# EAGLE schematic mainboard (EAGLE 6.3)

## Sheet 1 of 2
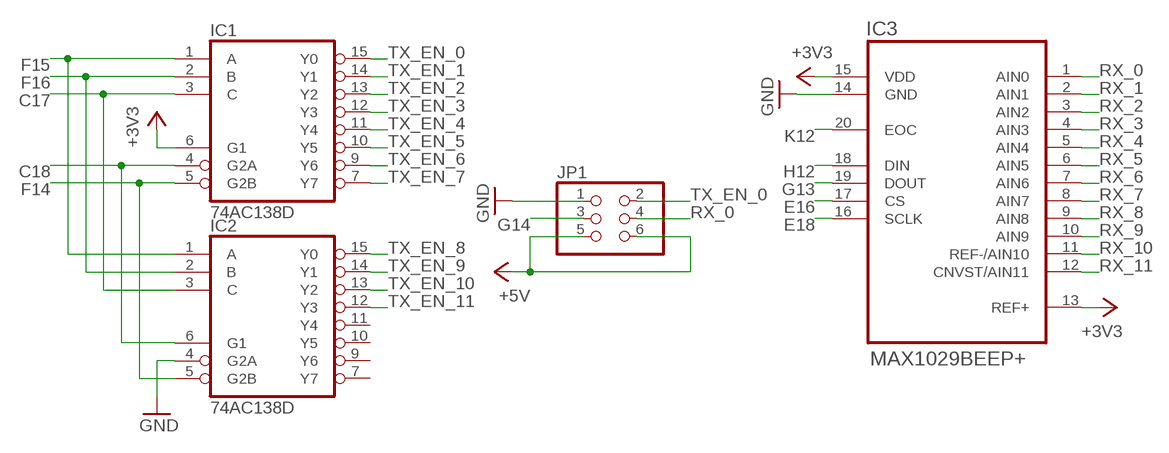
[diagram p0: schematic, sheet 1]

### Parts
IC1  74AC138D  [SO16]
IC2  74AC138D  [SO16]
IC3  MAX1029BEEP+  [SOP64P600X165-20N]
JP1  PINHD-2X3  [2X03]

### Nets
+3V3: IC1.6(G1) IC3.13(REF+) IC3.15(VDD) ; also sheet 2
+5V: JP1.5 JP1.6 ; also sheet 2
C17: IC1.3(C) IC2.3(C) ; also sheet 2
C18: IC1.4(G2A) IC2.6(G1) ; also sheet 2
E16: IC3.17(CS) ; also sheet 2
E18: IC3.16(SCLK) ; also sheet 2
F14: IC1.5(G2B) IC2.5(G2B) ; also sheet 2
F15: IC1.1(A) IC2.1(A) ; also sheet 2
F16: IC1.2(B) IC2.2(B) ; also sheet 2
G13: IC3.19(DOUT) ; also sheet 2
G14: JP1.3 ; also sheet 2
GND: IC2.4(G2A) IC3.14(GND) JP1.1 ; also sheet 2
H12: IC3.18(DIN) ; also sheet 2
K12: IC3.20(EOC) ; also sheet 2
RX_0: IC3.1(AIN0) JP1.4
RX_1: IC3.2(AIN1)
RX_2: IC3.3(AIN2)
RX_3: IC3.4(AIN3)
RX_4: IC3.5(AIN4)
RX_5: IC3.6(AIN5)
RX_6: IC3.7(AIN6)
RX_7: IC3.8(AIN7)
RX_8: IC3.9(AIN8)
RX_9: IC3.10(AIN9)
RX_10: IC3.11(REF-/AIN10)
RX_11: IC3.12(CNVST/AIN11)
TX_EN_0: IC1.15(Y0) JP1.2
TX_EN_1: IC1.14(Y1)
TX_EN_2: IC1.13(Y2)
TX_EN_3: IC1.12(Y3)
TX_EN_4: IC1.11(Y4)
TX_EN_5: IC1.10(Y5)
TX_EN_6: IC1.9(Y6)
TX_EN_7: IC1.7(Y7)
TX_EN_8: IC2.15(Y0)
TX_EN_9: IC2.14(Y1)
TX_EN_10: IC2.13(Y2)
TX_EN_11: IC2.12(Y3)
Unconnected: IC2.7(Y7) IC2.9(Y6) IC2.10(Y5) IC2.11(Y4)

## Sheet 2 of 2
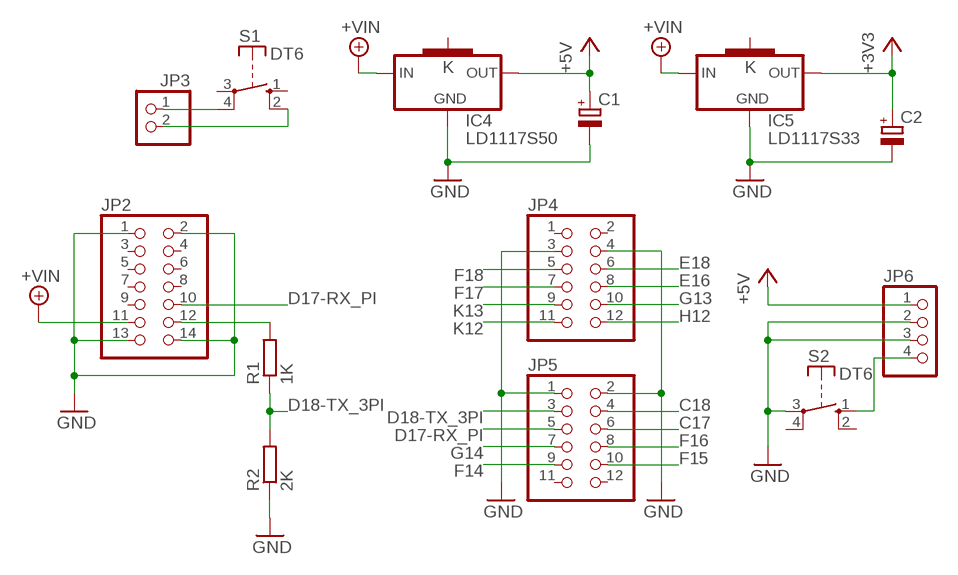
[diagram p1: schematic, sheet 2]

### Parts
C1  CPOL-EUE2.5-5  [E2,5-5]
C2  CPOL-EUE2.5-5  [E2,5-5]
IC4  LD1117S50  [SOT223]
IC5  LD1117S33  [SOT223]
JP2  PINHD-2X7  [2X07]
JP3  PINHD-1X2  [1X02]
JP4  PINHD-2X6  [2X06]
JP5  PINHD-2X6  [2X06]
JP6  PINHD-1X4  [1X04]
R1  1K  R-EU_R0805  [R0805]
R2  2K  R-EU_R0805  [R0805]
S1  DT6  [DT6]
S2  DT6  [DT6]

### Nets
+3V3: C2.+ IC5.2(OUT) ; also sheet 1
+5V: C1.+ IC4.2(OUT) JP6.1 ; also sheet 1
+VIN: IC4.3(IN) IC5.3(IN) JP2.11
C17: JP5.6 ; also sheet 1
C18: JP5.4 ; also sheet 1
D17-RX_PI: JP2.10 JP5.5
D18-TX_3PI: JP5.3 R1.1 R2.2
E16: JP4.8 ; also sheet 1
E18: JP4.6 ; also sheet 1
F14: JP5.9 ; also sheet 1
F15: JP5.10 ; also sheet 1
F16: JP5.8 ; also sheet 1
F17: JP4.7
F18: JP4.5
G13: JP4.10 ; also sheet 1
G14: JP5.7 ; also sheet 1
GND: C1.- C2.- IC4.1(GND) IC5.1(GND) JP2.1 JP2.2 JP2.13 JP2.14 JP4.3 JP4.4 JP5.1 JP5.2 JP6.2 JP6.3 R2.1 S2.3(P) ; also sheet 1
H12: JP4.12 ; also sheet 1
K12: JP4.11 ; also sheet 1
K13: JP4.9
N$1: JP6.4 S2.1(S)
N$2: JP3.1 S1.4(P)
N$3: JP3.2 S1.2(S)
TX_3PI: JP2.12 R1.2
Unconnected: IC4.4(K) IC5.4(K) JP2.3 JP2.4 JP2.5 JP2.6 JP2.7 JP2.8 JP2.9 JP4.1 JP4.2 JP5.11 JP5.12 S1.1(S) S1.3(P) S2.2(S) S2.4(P)

## Power pins joined to a net without a drawn wire
GND: IC1.8(GND) IC2.8(GND)
VCC: IC1.16(VCC) IC2.16(VCC)

## Library data of the parts
C1 C2 = rcl:CPOL-EU: POLARIZED CAPACITOR, European symbol
IC1 IC2 = 74xx-eu:74*138: 3-line to 8-line DECODER/DEMULTIPLEXER; OC_FARNELL: 1201320
IC3 = Ultrasound:MAX1029BEEP+; OC_FARNELL: 1714967
IC4 = mbed-ics:LD1117S50: VOLTAGE REGULATOR SMD 5V
IC5 = mbed-ics:LD1117S33: VOLTAGE REGULATOR SMD 3,3V
JP1 = pinhead:PINHD-2X3: PIN HEADER
JP2 = pinhead:PINHD-2X7: PIN HEADER
JP3 = pinhead:PINHD-1X2: PIN HEADER
JP4 JP5 = pinhead:PINHD-2X6: PIN HEADER
JP6 = pinhead:PINHD-1X4: PIN HEADER
R1 R2 = rcl:R-EU_: RESISTOR, European symbol
S1 S2 = switch-misc:DT: ITT SWITCH